# Altium schematic sheet MB997.SchDoc
size A4; DocumentNumber: 1; Revision: B.2(PCB.SCH); SheetNumber: 1; SheetTotal: 6; PageSetup: Record=PageOptions|CenterHorizontal=True|CenterVertical=True|PrintScale=1.00|XCorrection=1.00|YCorrection=1.00|PrintKind=1|BorderSize=5000000|LeftOffset=0|BottomOffset=0|Orientation=2|PaperLength=1000|PaperWidth=1000|Scale=100|PaperSource=15|PrintQuality=1200|MediaType=1|DitherType=10|PaperKind=A4|PrintScaleMode=1
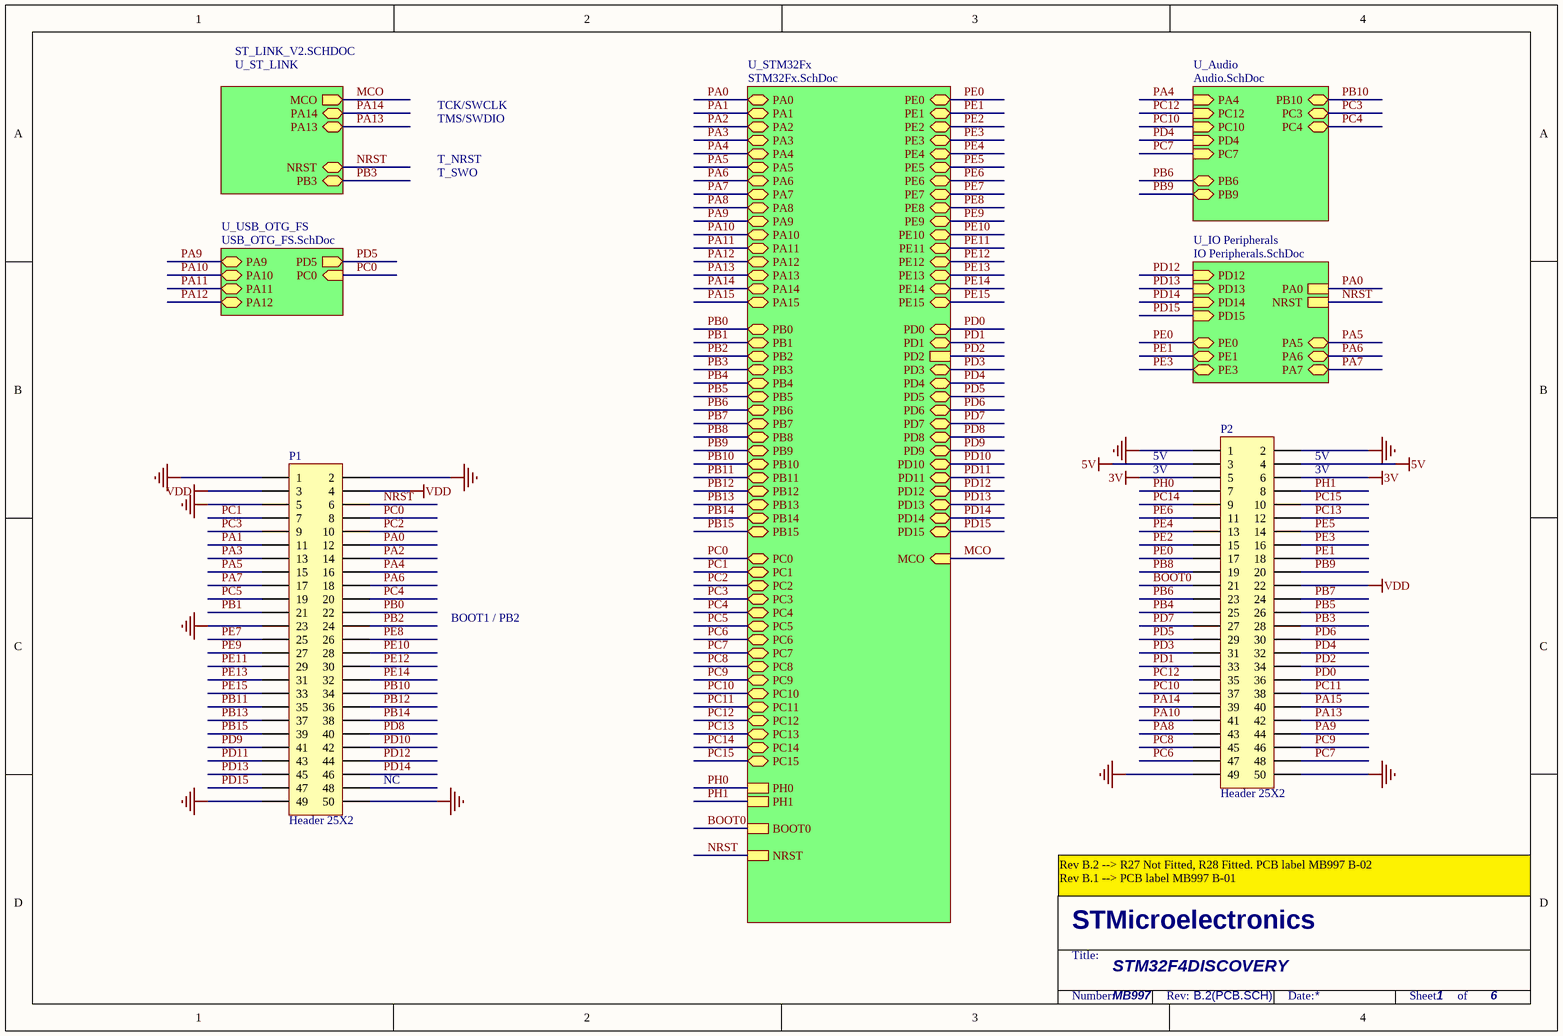
[diagram p0: MB997.SchDoc]

## Parts
P1  Header 25X2  [HDR2X25]
P2  Header 25X2  [HDR2X25]

## Sub-sheets
U_Audio = Audio.SchDoc: PA4 (in), PC12 (in), PC10 (in), PB6 (bidir), PB9 (bidir), PD4 (in), PC7 (in), PC3, PB10, PC4
U_IO Peripherals = IO Peripherals.SchDoc: PA0, NRST, PD12 (in), PE0, PD13 (in), PD14 (in), PD15 (in), PE1, PA5 (bidir), PA7 (bidir), PE3, PA6 (bidir)
U_ST_LINK = ST_LINK_V2.SCHDOC: PA13, PA14, NRST, PB3, MCO (out)
U_STM32Fx = STM32Fx.SchDoc: PA13 (bidir), PA14 (bidir), PA15 (bidir), PA12 (bidir), PA0 (bidir), PA1 (bidir), PA2 (bidir), PA3 (bidir), PA4 (bidir), PA5 (bidir), PA6 (bidir), PA7 (bidir), PA8 (bidir), PA9 (bidir), PA10 (bidir), PA11 (bidir), PB12 (bidir), PB0 (bidir), PB1 (bidir), PB2 (bidir), PB3 (bidir), PB4 (bidir), PB5 (bidir), PB6 (bidir), PB7 (bidir), PB8 (bidir), PB9 (bidir), PB10 (bidir), PB11 (bidir), PB13 (bidir), PB14 (bidir), PB15 (bidir), PC3 (bidir), PC15 (bidir), PC14 (bidir), PC13 (bidir), PC12 (bidir), PC11 (bidir), PC10 (bidir), PC9 (bidir), PC8 (bidir), PC7 (bidir), PC6 (bidir), PC5 (bidir), PC4 (bidir), PC2 (bidir), PC1 (bidir), PC0 (bidir), PD2, BOOT0, PH1, PH0, NRST, MCO (in), PE0, PE1, PE2, PE3, PE4, PE5, PE6, PE7, PE8, PE9, PE10, PE11, PE12, PE13, PE14, PE15, PD0, PD1, PD3, PD4, PD5, PD6, PD7, PD8, PD9, PD10, PD11, PD12, PD13, PD14, PD15
U_USB_OTG_FS = USB_OTG_FS.SchDoc: PD5 (out), PA11 (bidir), PA12 (bidir), PC0 (in), PA10 (bidir), PA9 (bidir)

## Nets
3V: P2.5 P2.6
5V: P2.3 P2.4
GND: P1.1 P1.2 P1.5 P1.23 P1.49 P1.50 P2.1 P2.2 P2.49 P2.50
VDD: P1.3 P1.4 P2.22
BOOT0: P2.21 ; sheet U_STM32Fx/BOOT0
MCO: sheet U_ST_LINK/MCO, sheet U_STM32Fx/MCO
NRST: P1.6 ; sheet U_ST_LINK/NRST, sheet U_IO Peripherals/NRST, sheet U_STM32Fx/NRST
PA0: P1.12 ; sheet U_IO Peripherals/PA0, sheet U_STM32Fx/PA0
PA1: P1.11 ; sheet U_STM32Fx/PA1
PA2: P1.14 ; sheet U_STM32Fx/PA2
PA3: P1.13 ; sheet U_STM32Fx/PA3
PA4: P1.16 ; sheet U_Audio/PA4, sheet U_STM32Fx/PA4
PA5: P1.15 ; sheet U_IO Peripherals/PA5, sheet U_STM32Fx/PA5
PA6: P1.18 ; sheet U_IO Peripherals/PA6, sheet U_STM32Fx/PA6
PA7: P1.17 ; sheet U_IO Peripherals/PA7, sheet U_STM32Fx/PA7
PA8: P2.43 ; sheet U_STM32Fx/PA8
PA9: P2.44 ; sheet U_STM32Fx/PA9, sheet U_USB_OTG_FS/PA9
PA10: P2.41 ; sheet U_STM32Fx/PA10, sheet U_USB_OTG_FS/PA10
PA11: sheet U_STM32Fx/PA11, sheet U_USB_OTG_FS/PA11
PA12: sheet U_STM32Fx/PA12, sheet U_USB_OTG_FS/PA12
PA13: P2.42 ; sheet U_ST_LINK/PA13, sheet U_STM32Fx/PA13
PA14: P2.39 ; sheet U_ST_LINK/PA14, sheet U_STM32Fx/PA14
PA15: P2.40 ; sheet U_STM32Fx/PA15
PB0: P1.22 ; sheet U_STM32Fx/PB0
PB1: P1.21 ; sheet U_STM32Fx/PB1
PB2: P1.24 ; sheet U_STM32Fx/PB2
PB3: P2.28 ; sheet U_ST_LINK/PB3, sheet U_STM32Fx/PB3
PB4: P2.25 ; sheet U_STM32Fx/PB4
PB5: P2.26 ; sheet U_STM32Fx/PB5
PB6: P2.23 ; sheet U_Audio/PB6, sheet U_STM32Fx/PB6
PB7: P2.24 ; sheet U_STM32Fx/PB7
PB8: P2.19 ; sheet U_STM32Fx/PB8
PB9: P2.20 ; sheet U_Audio/PB9, sheet U_STM32Fx/PB9
PB10: P1.34 ; sheet U_Audio/PB10, sheet U_STM32Fx/PB10
PB11: P1.35 ; sheet U_STM32Fx/PB11
PB12: P1.36 ; sheet U_STM32Fx/PB12
PB13: P1.37 ; sheet U_STM32Fx/PB13
PB14: P1.38 ; sheet U_STM32Fx/PB14
PB15: P1.39 ; sheet U_STM32Fx/PB15
PC0: P1.8 ; sheet U_STM32Fx/PC0, sheet U_USB_OTG_FS/PC0
PC1: P1.7 ; sheet U_STM32Fx/PC1
PC2: P1.10 ; sheet U_STM32Fx/PC2
PC3: P1.9 ; sheet U_Audio/PC3, sheet U_STM32Fx/PC3
PC4: P1.20 ; sheet U_Audio/PC4, sheet U_STM32Fx/PC4
PC5: P1.19 ; sheet U_STM32Fx/PC5
PC6: P2.47 ; sheet U_STM32Fx/PC6
PC7: P2.48 ; sheet U_Audio/PC7, sheet U_STM32Fx/PC7
PC8: P2.45 ; sheet U_STM32Fx/PC8
PC9: P2.46 ; sheet U_STM32Fx/PC9
PC10: P2.37 ; sheet U_Audio/PC10, sheet U_STM32Fx/PC10
PC11: P2.38 ; sheet U_STM32Fx/PC11
PC12: P2.35 ; sheet U_Audio/PC12, sheet U_STM32Fx/PC12
PC13: P2.12 ; sheet U_STM32Fx/PC13
PC14: P2.9 ; sheet U_STM32Fx/PC14
PC15: P2.10 ; sheet U_STM32Fx/PC15
PD0: P2.36 ; sheet U_STM32Fx/PD0
PD1: P2.33 ; sheet U_STM32Fx/PD1
PD2: P2.34 ; sheet U_STM32Fx/PD2
PD3: P2.31 ; sheet U_STM32Fx/PD3
PD4: P2.32 ; sheet U_Audio/PD4, sheet U_STM32Fx/PD4
PD5: P2.29 ; sheet U_STM32Fx/PD5, sheet U_USB_OTG_FS/PD5
PD6: P2.30 ; sheet U_STM32Fx/PD6
PD7: P2.27 ; sheet U_STM32Fx/PD7
PD8: P1.40 ; sheet U_STM32Fx/PD8
PD9: P1.41 ; sheet U_STM32Fx/PD9
PD10: P1.42 ; sheet U_STM32Fx/PD10
PD11: P1.43 ; sheet U_STM32Fx/PD11
PD12: P1.44 ; sheet U_IO Peripherals/PD12, sheet U_STM32Fx/PD12
PD13: P1.45 ; sheet U_IO Peripherals/PD13, sheet U_STM32Fx/PD13
PD14: P1.46 ; sheet U_IO Peripherals/PD14, sheet U_STM32Fx/PD14
PD15: P1.47 ; sheet U_IO Peripherals/PD15, sheet U_STM32Fx/PD15
PE0: P2.17 ; sheet U_IO Peripherals/PE0, sheet U_STM32Fx/PE0
PE1: P2.18 ; sheet U_IO Peripherals/PE1, sheet U_STM32Fx/PE1
PE2: P2.15 ; sheet U_STM32Fx/PE2
PE3: P2.16 ; sheet U_IO Peripherals/PE3, sheet U_STM32Fx/PE3
PE4: P2.13 ; sheet U_STM32Fx/PE4
PE5: P2.14 ; sheet U_STM32Fx/PE5
PE6: P2.11 ; sheet U_STM32Fx/PE6
PE7: P1.25 ; sheet U_STM32Fx/PE7
PE8: P1.26 ; sheet U_STM32Fx/PE8
PE9: P1.27 ; sheet U_STM32Fx/PE9
PE10: P1.28 ; sheet U_STM32Fx/PE10
PE11: P1.29 ; sheet U_STM32Fx/PE11
PE12: P1.30 ; sheet U_STM32Fx/PE12
PE13: P1.31 ; sheet U_STM32Fx/PE13
PE14: P1.32 ; sheet U_STM32Fx/PE14
PE15: P1.33 ; sheet U_STM32Fx/PE15
PH0: P2.7 ; sheet U_STM32Fx/PH0
PH1: P2.8 ; sheet U_STM32Fx/PH1

Not connected (* = marked no-connect by the designer): P1 48

## Notes on the sheet
- TCK/SWCLK
- TMS/SWDIO
- T_SWO
- T_NRST
- 5V
- 3V
- (near P2) 5V
- (near P2) 3V
- BOOT1 / PB2
- (near P1) NC
- Rev B.2 --> R27 Not Fitted, R28 Fitted. PCB label MB997 B-02
  Rev B.1 --> PCB label MB997 B-01
- STM32F4DISCOVERY
- MB997
- 1
- STMicroelectronics
- Title:
- Number:
- Rev:
- Date:
- Sheet       of

## Library data of the parts
P1 P2 = Header 25X2: Header, 25-Pin, Dual row; LatestRevisionDate: 17-Jul-2002; LatestRevisionNote: Re-released for DXP Platform.; Publisher: Altium Limited